# Altium project VNGS01 V1.32.PrjPcb
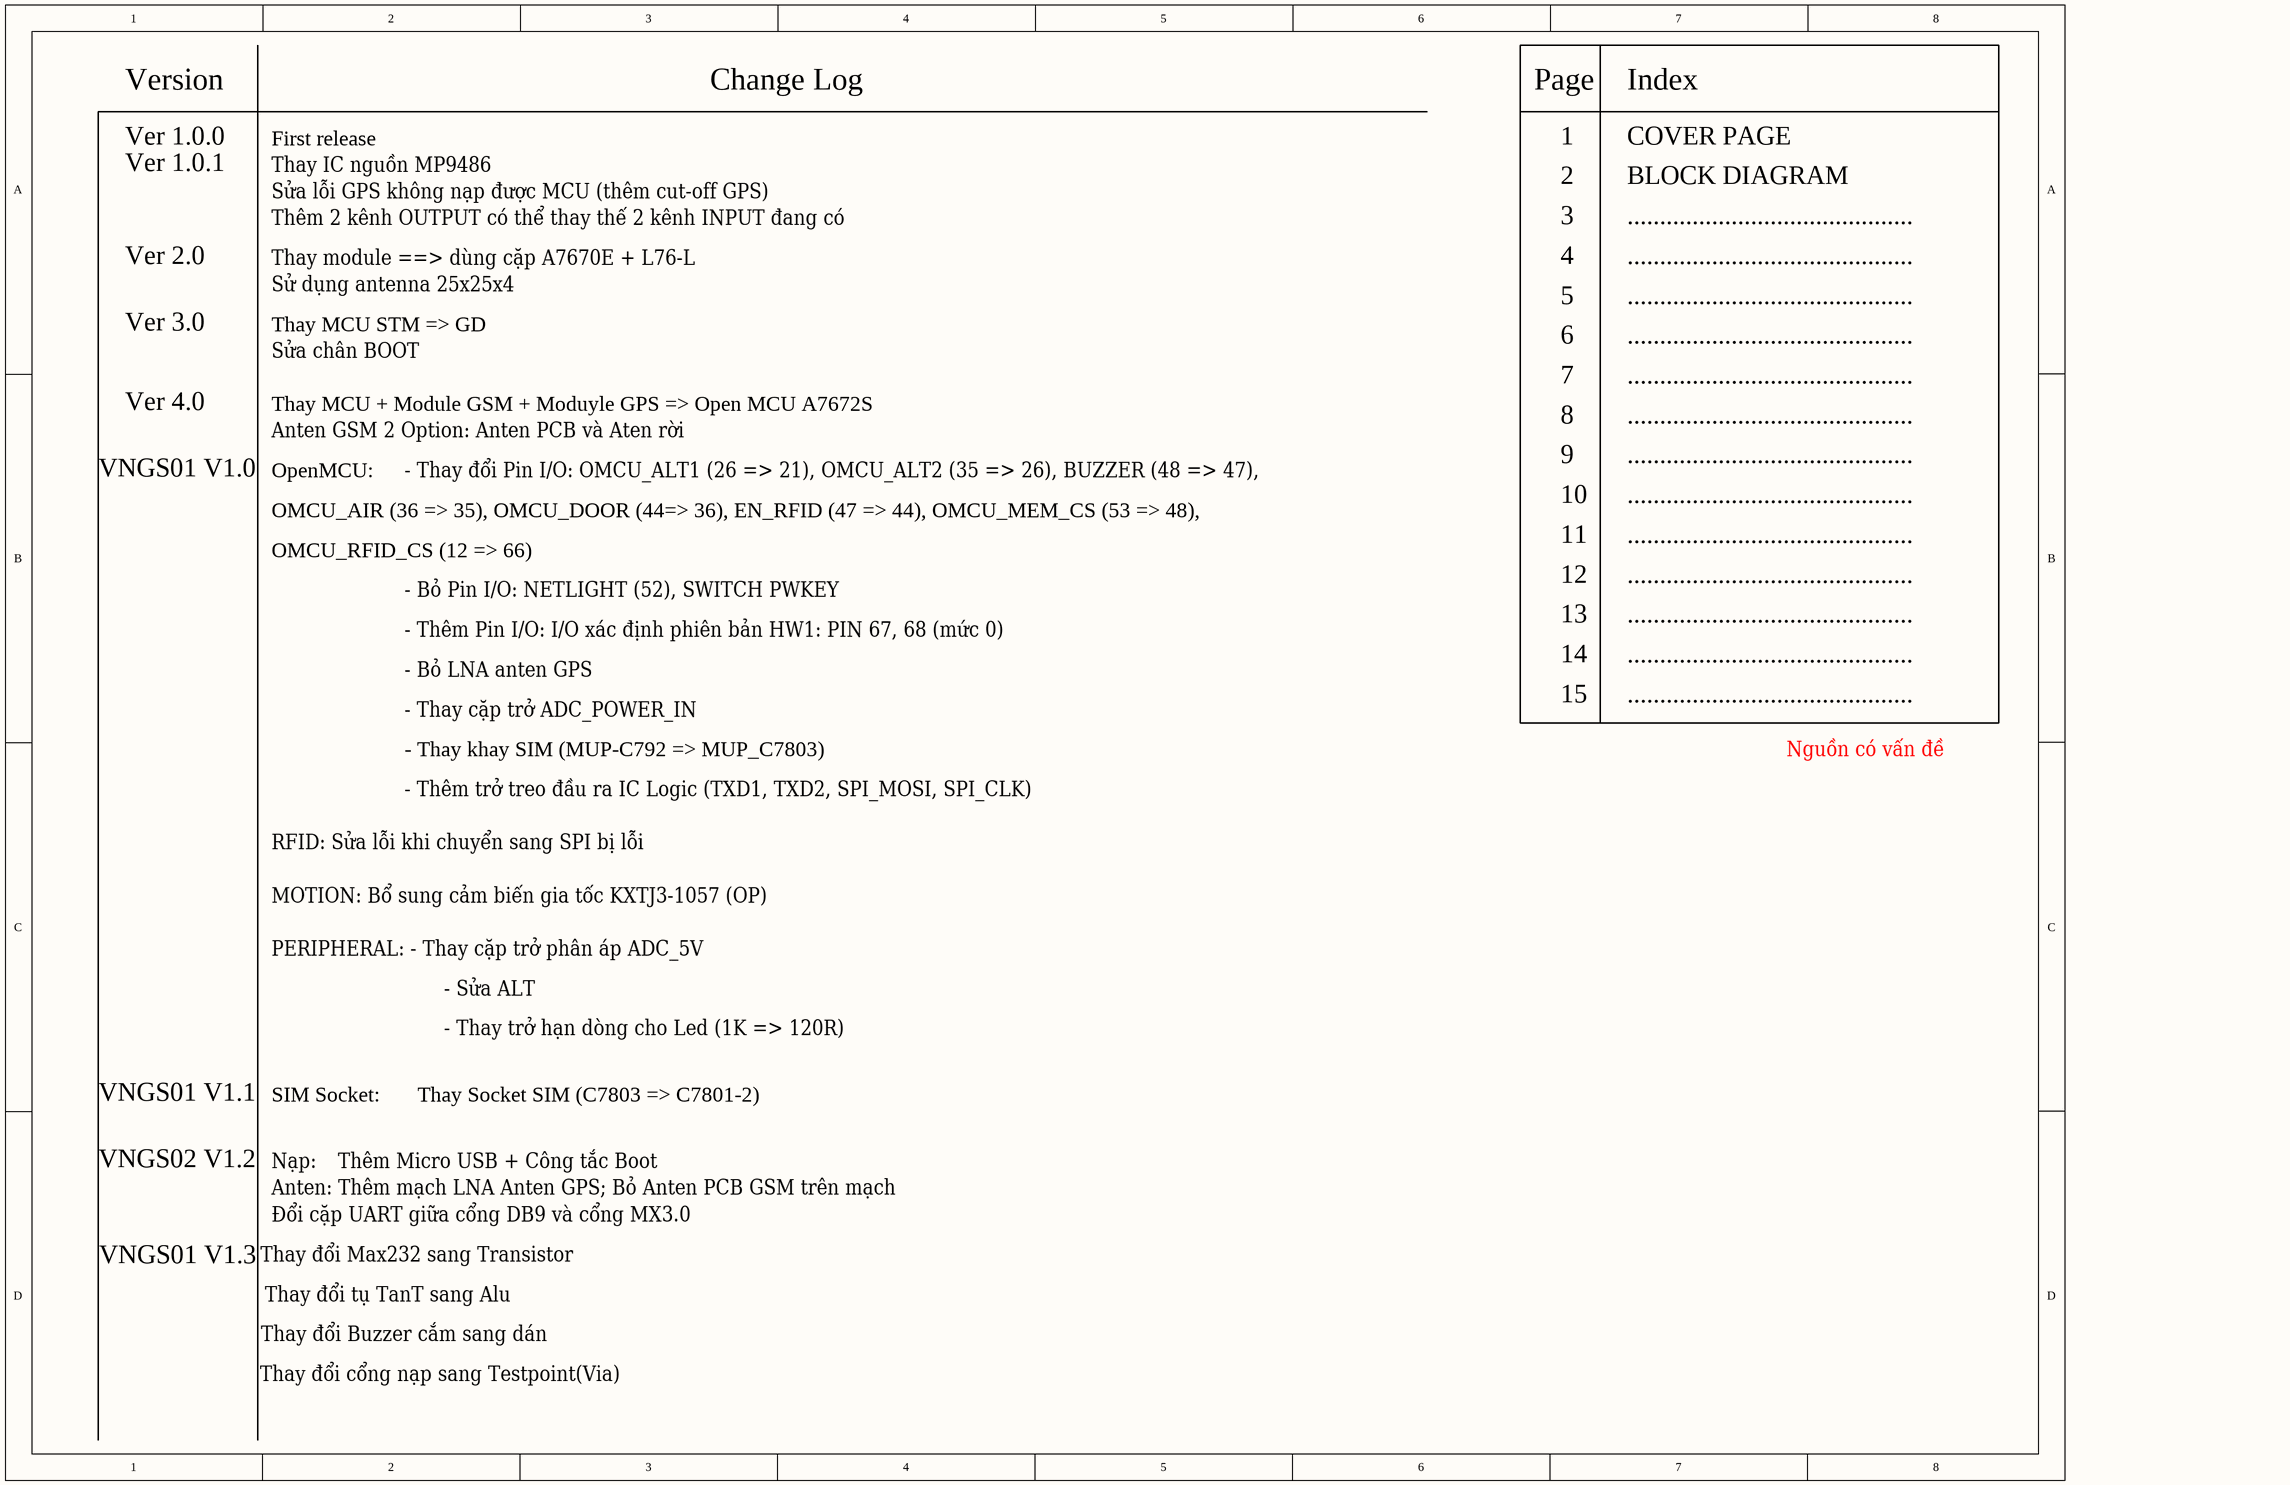
[diagram p0: 01 Cover.SchDoc]
4 sheets, 118 parts. Net scope: global (net labels, ports and power ports of the same name join across sheets).
Board file: VNGS01 V1.32.PcbDoc
Sheets:
  01 Cover.SchDoc
  03 Power DC.SchDoc
  04 Open MCU.SchDoc
  05 RFID.SchDoc

## Sheet 01 Cover.SchDoc
size A3

### Notes on the sheet
- Version
- Change Log
- Page
- Index
- Ver 1.0.0
- Ver 1.0.1
- First release
- Thay IC nguồn MP9486
- 1
- COVER PAGE
- Sửa lỗi GPS không nạp được MCU (thêm cut-off GPS)
- Thêm 2 kênh OUTPUT có thể thay thế 2 kênh INPUT đang có
- 2
- 3
- BLOCK DIAGRAM
- ............................................
- Ver 2.0
- Thay module ==> dùng cặp A7670E + L76-L
- Sử dụng antenna 25x25x4
- 4
- 5
- Ver 3.0
- Thay MCU STM => GD
- Sửa chân BOOT
- 6
- Ver 4.0
- Thay MCU + Module GSM + Moduyle GPS => Open MCU A7672S
- Anten GSM 2 Option: Anten PCB và Aten rời
- 7
- 8
- VNGS01 V1.0
- OpenMCU:
- - Thay đổi Pin I/O: OMCU_ALT1 (26 => 21), OMCU_ALT2 (35 => 26), BUZZER (48 => 47),
- 9
- 10
- OMCU_AIR (36 => 35), OMCU_DOOR (44=> 36), EN_RFID (47 => 44), OMCU_MEM_CS (53 => 48),
- OMCU_RFID_CS (12 => 66)
- 11
- - Bỏ Pin I/O: NETLIGHT (52), SWITCH PWKEY
- - Thêm Pin I/O: I/O xác định phiên bản HW1: PIN 67, 68 (mức 0)
- 12
- 13
- - Bỏ LNA anten GPS
- 14
- 15
- - Thay cặp trở ADC_POWER_IN
- - Thay khay SIM (MUP-C792 => MUP_C7803)
- Nguồn có vấn đề
- - Thêm trở treo đầu ra IC Logic (TXD1, TXD2, SPI_MOSI, SPI_CLK)
- RFID: Sửa lỗi khi chuyển sang SPI bị lỗi
- MOTION: Bổ sung cảm biến gia tốc KXTJ3-1057 (OP)
- PERIPHERAL: - Thay cặp trở phân áp ADC_5V
- - Sửa ALT
- - Thay trở hạn dòng cho Led (1K => 120R)
- VNGS01 V1.1
- SIM Socket:
- Thay Socket SIM (C7803 => C7801-2)
- VNGS02 V1.2
- Nạp:
- Thêm Micro USB + Công tắc Boot
- Anten: Thêm mạch LNA Anten GPS; Bỏ Anten PCB GSM trên mạch
- Đổi cặp UART giữa cổng DB9 và cổng MX3.0
- VNGS01 V1.3
- Thay đổi tụ TanT sang Alu
- Thay đổi Max232 sang Transistor
- Thay đổi Buzzer cắm sang dán
- Thay đổi cổng nạp sang Testpoint(Via)

## Sheet 03 Power DC.SchDoc: POWER DC
size A4; DrawnBy: Cuong RnD HW; Revision: V4.0
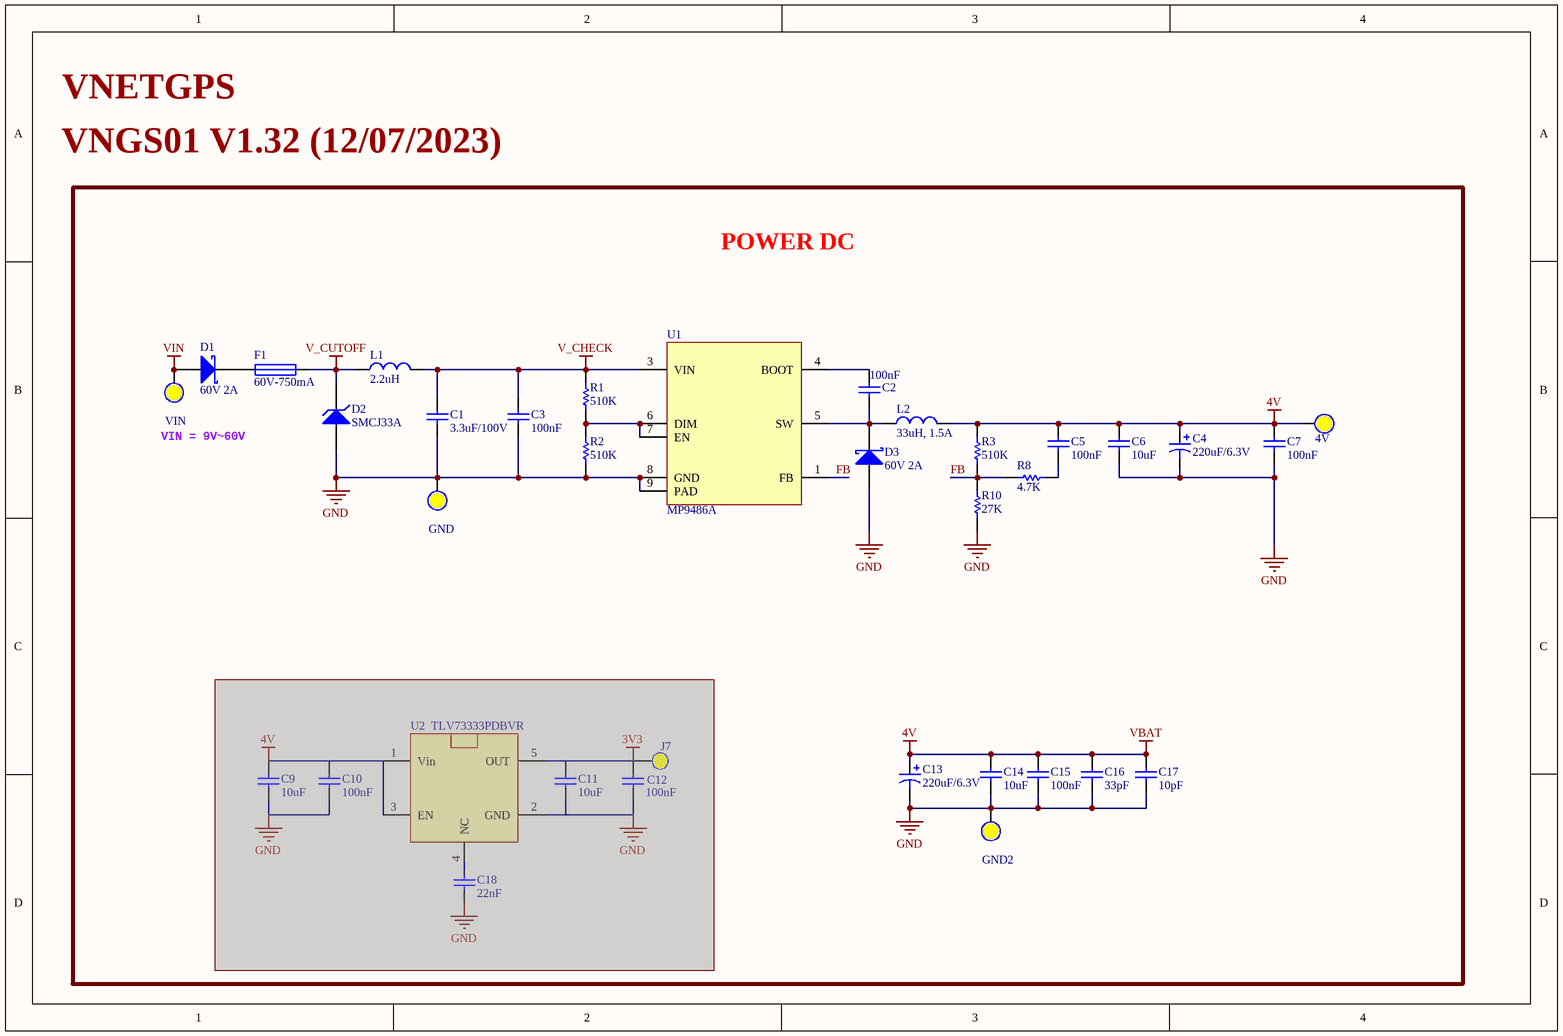
[diagram p1: 03 Power DC.SchDoc]

### Parts
(Parts that share a designator on the sheet are numbered #1, #2 ... from top to bottom, then left to right.)
4V  (no value)  [Test Point 1 MM]  (no BOM)
C1  3.3uF/100V  [1210 - C]
C2  100nF  [0603 - C]
C3  100nF  [0603 - C]
C4  220uF/6.3V  [CAP_ALUM_SMD_6354_TYPE_D]
C5  100nF  [0603 - C]
C6  10uF  [0603 - C]
C7  100nF  [0603 - C]
C9#1  10uF  [0603 - C]  (masked out: inside a compile mask, not in the netlist)
C10#1  100nF  [0603 - C]  (masked out: inside a compile mask, not in the netlist)
C11#1  10uF  [0603 - C]  (masked out: inside a compile mask, not in the netlist)
C12#1  100nF  [0603 - C]  (masked out: inside a compile mask, not in the netlist)
C13  220uF/6.3V  [CAP_ALUM_SMD_6354_TYPE_D]
C14  value 10uF  [0603 - C]  (hidden comment: 1uF)
C15  100nF  [0603 - C]
C16#1  33pF  [0603 - C]
C17  10pF  [0603 - C]
C18  22nF  [0603 - C]  (masked out: inside a compile mask, not in the netlist)
D1  60V 2A  [SOD-123]
D2  SMCJ33A  [DIODE - SMC]
D3  60V 2A  [SOD-123]
F1  60V-750mA  [2016 - Fuse]
GND  (no value)  [Test Point 1 MM]  (no BOM)
GND2  (no value)  [Test Point 1 MM]  (no BOM)
J7  Test Point  [TP1]  (value not drawn)  (masked out: inside a compile mask, not in the netlist)
L1  2.2uH  [1210 - L]
L2  33uH, 1.5A  [INDUCTOR-5D28]
R1  510K  [0603 - R]
R2  510K  [0603 - R]
R3  510K  [0603 - R]
R8  4.7K  [0603 - R]
R10#1  27K  [0603 - R]
U1  MP9486A  [SOIC8 - POWER]
U2#1  TLV73333PDBVR  [SOT23-5]  (masked out: inside a compile mask, not in the netlist)
VIN  (no value)  [Test Point 1 MM]  (no BOM)

### Nets
4V: 4V.0 C4.1 C5.1 C6.2 C7.2 C13.1 C14.2 C15.2 C16#1.2 C17.2 L2.2 R3.2  [also labelled VBAT]
GND: C1.1 C3.1 C4.2 C6.1 C7.1 C13.2 C14.1 C15.1 C16#1.1 C17.1 D2.1(A) D3.1(A) GND.0 GND2.0 R2.1 R10#1.1 U1.8(GND) U1.9(PAD)
V_CHECK: C1.2 C3.2 L1.2 R1.2 U1.3(VIN)
V_CUTOFF: D2.2(K) F1.2 L1.1
VIN: D1.1(A) VIN.0
FB: R3.1 R8.1 R10#1.2 U1.1(FB)
NetC2_1: C2.1 U1.4(BOOT)
NetC2_2: C2.2 D3.2(K) L2.1 U1.5(SW)
NetC5_2: C5.2 R8.2
NetD1_2: D1.2(K) F1.1
NetR1_1: R1.1 R2.2 U1.6(DIM) U1.7(EN)

### Notes on the sheet
- VNETGPS
- VNGS01 V1.32 (12/07/2023)
- POWER DC
- VIN = 9V~60V

### Library data of the parts
4V GND GND2 VIN = Test Point: Solder: NF
C1 = Cap 1210 3.3uF: CAP CER 3.3UF 100V X7S 1210; MPN: C3225X7S2A335M200AB; MFR: TDK Corporation; Company ID: VT_CAP_C1210 3.3uF 100V; Size: C1210: 3.3uF/100V; MPN2: 885012209071; Value: 3.3uF/100V
C2 C3 C5 C7 C10#1 C12#1 C15 = Cap 0603 100nF: CAP CER 100nF 50V C0G/NP0 0603; MPN: CL10C104JB8NNNC; MFR: SAMSUNG; Company ID: VT_TỤ ĐIỆN_C0603 100nF; Voltage: 50V; Package: 0603; Value: 100nF; Size: C0603: 100nF
C4 C13 = Cap Alu 220uF/6.3V: CAP.EL.220uF 6.3V 6.3x5.4 85C 2000H SMT; MPN: CS006M221E5APKKKV00R; MFR: Su'scon; Company ID: VT_CAP ALU 220uF 6.3V; Value: 220uF/6.3V
C6 C9#1 C11#1 C14 = Cap 0603 10uF: CAP CER 10UF 16V X5R 0603; MPN: EMK107BBJ106MA-T; MFR: Yageo; Company ID: VT_CAP_C0603 10uF; Size: C0603: 10uF; Package: 0603
  C6 C9#1 C11#1: Value: 10uF
C16#1 = Cap 0603 33pF: CAP CER 33PF 50V C0G 0603; MFR: Yageo; MPN: AC0603FRNPO9BN330; Company ID: VT_CAP_C0603 33pF; Size: C0603: 33pF; Value: 33pF
C17 = Cap 0603 10pF: CAP CER 10PF 50V C0G/NP0 0603; MPN: CL10C100JB8NNNC; MFR: SAMSUNG; Company ID: VT_CAP_C0603 10pF; Size: C0603: 10pF; Value: 10pF
C18 = Cap 0603 22nF_1: CAP CER 0.022UF 50V X7R 0603; MPN: CL10B823KB8NNNC; MFR: SAMSUNG; Company ID: VT_CAP_C0603 22nF; Size: C0603: 82nF; Value: 22nF
D1 D3 = Diode PMEG6020ER: DIODE SCHOTTKY 60V 2A SOD123W; MPN: PMEG6020ER,115; MFR: NXP; Company ID: VT_DIODE_PMEG6020ER
D2 = SMCJ33A: TVS DIODE 33V 36.7V; MFR: Bourns Inc.; MPN: SMCJ33ABTR-ND; Company ID: VT_DIODE_ SMCJ33
F1 = Fuse 60V - 750mA: PTC RESET FUSE 60V 750MA 2016; MFR: Littelfuse Inc.; MPN: 2016L075/60MR; Company ID: VT_Fuse_60V - 750mA
J7 = TP: 1mm - 1 layer
L1 = Inductor 3225 2.2uH: FIXED IND 2.2UH 1.6A 76 MOHM SMD; MPN: LQH32PN2R2NN0; MFR: Murata; Company ID: VT_IND_3225 2.2uH; Value: 2.2uH; Size: L3225: 2.2uH; MPN2: SWPA3015S2R2NT
L2 = Inductor 33uH, 1.5A: FIXED IND 33UH 1.5A 286 MOHM SMD; MPN: SWPA6028S330MT; MFR: SunLord; Company ID: VT_IND_33uH/1.5A
R1 R2 = Res 0603 510K: RES SMD 510K OHM 1% 1/10W 0603; MFR: Yageo; MPN: RC0603FR-07510KL; Company ID: VT_ĐIỆN TRỞ_R0603 510K; Value: 510K; Size: R0603: 510K
R3 = Res 0603 510K: RES SMD 510K OHM 1% 1/10W 0603; MFR: Yageo; MPN: RC0603FR-07510KL; Company ID: VT_RES_R0603 510K; Size: R0603: 510K; Value: 510K
R8 = Res 0603 4.7K: RES SMD 4.7K OHM 1% 1/10W 0603; MFR: Yageo; MPN: RC0603FR-074K7L; Company ID: VT_RES_R0603 4.7K; Size: R0603: 4.7K; Value: 4.7K
R10#1 = Res 0603 27K: RES SMD 27K OHM 1% 1/10W 0603; MFR: YAGEO; MPN: AF0603FR-0727KL; Company ID: VT_RES_R0603 27K; Size: R0603: 27K; Value: 27K
U1 = MP9486AG: IC REG 100V INPT 3.5A SWITCH CUR; MPN: MP9486AGN-Z; MFR: MPS; Company ID: VT_IC_MP9486A
U2#1 = TLV73333PDBVR: IC REG LINEAR 3.3V 300MA SOT23-5; MFR: TI; Company ID: VT_IC_TLV73333; MPN: TLV73333PDBVR

## Sheet 04 Open MCU.SchDoc
size A3
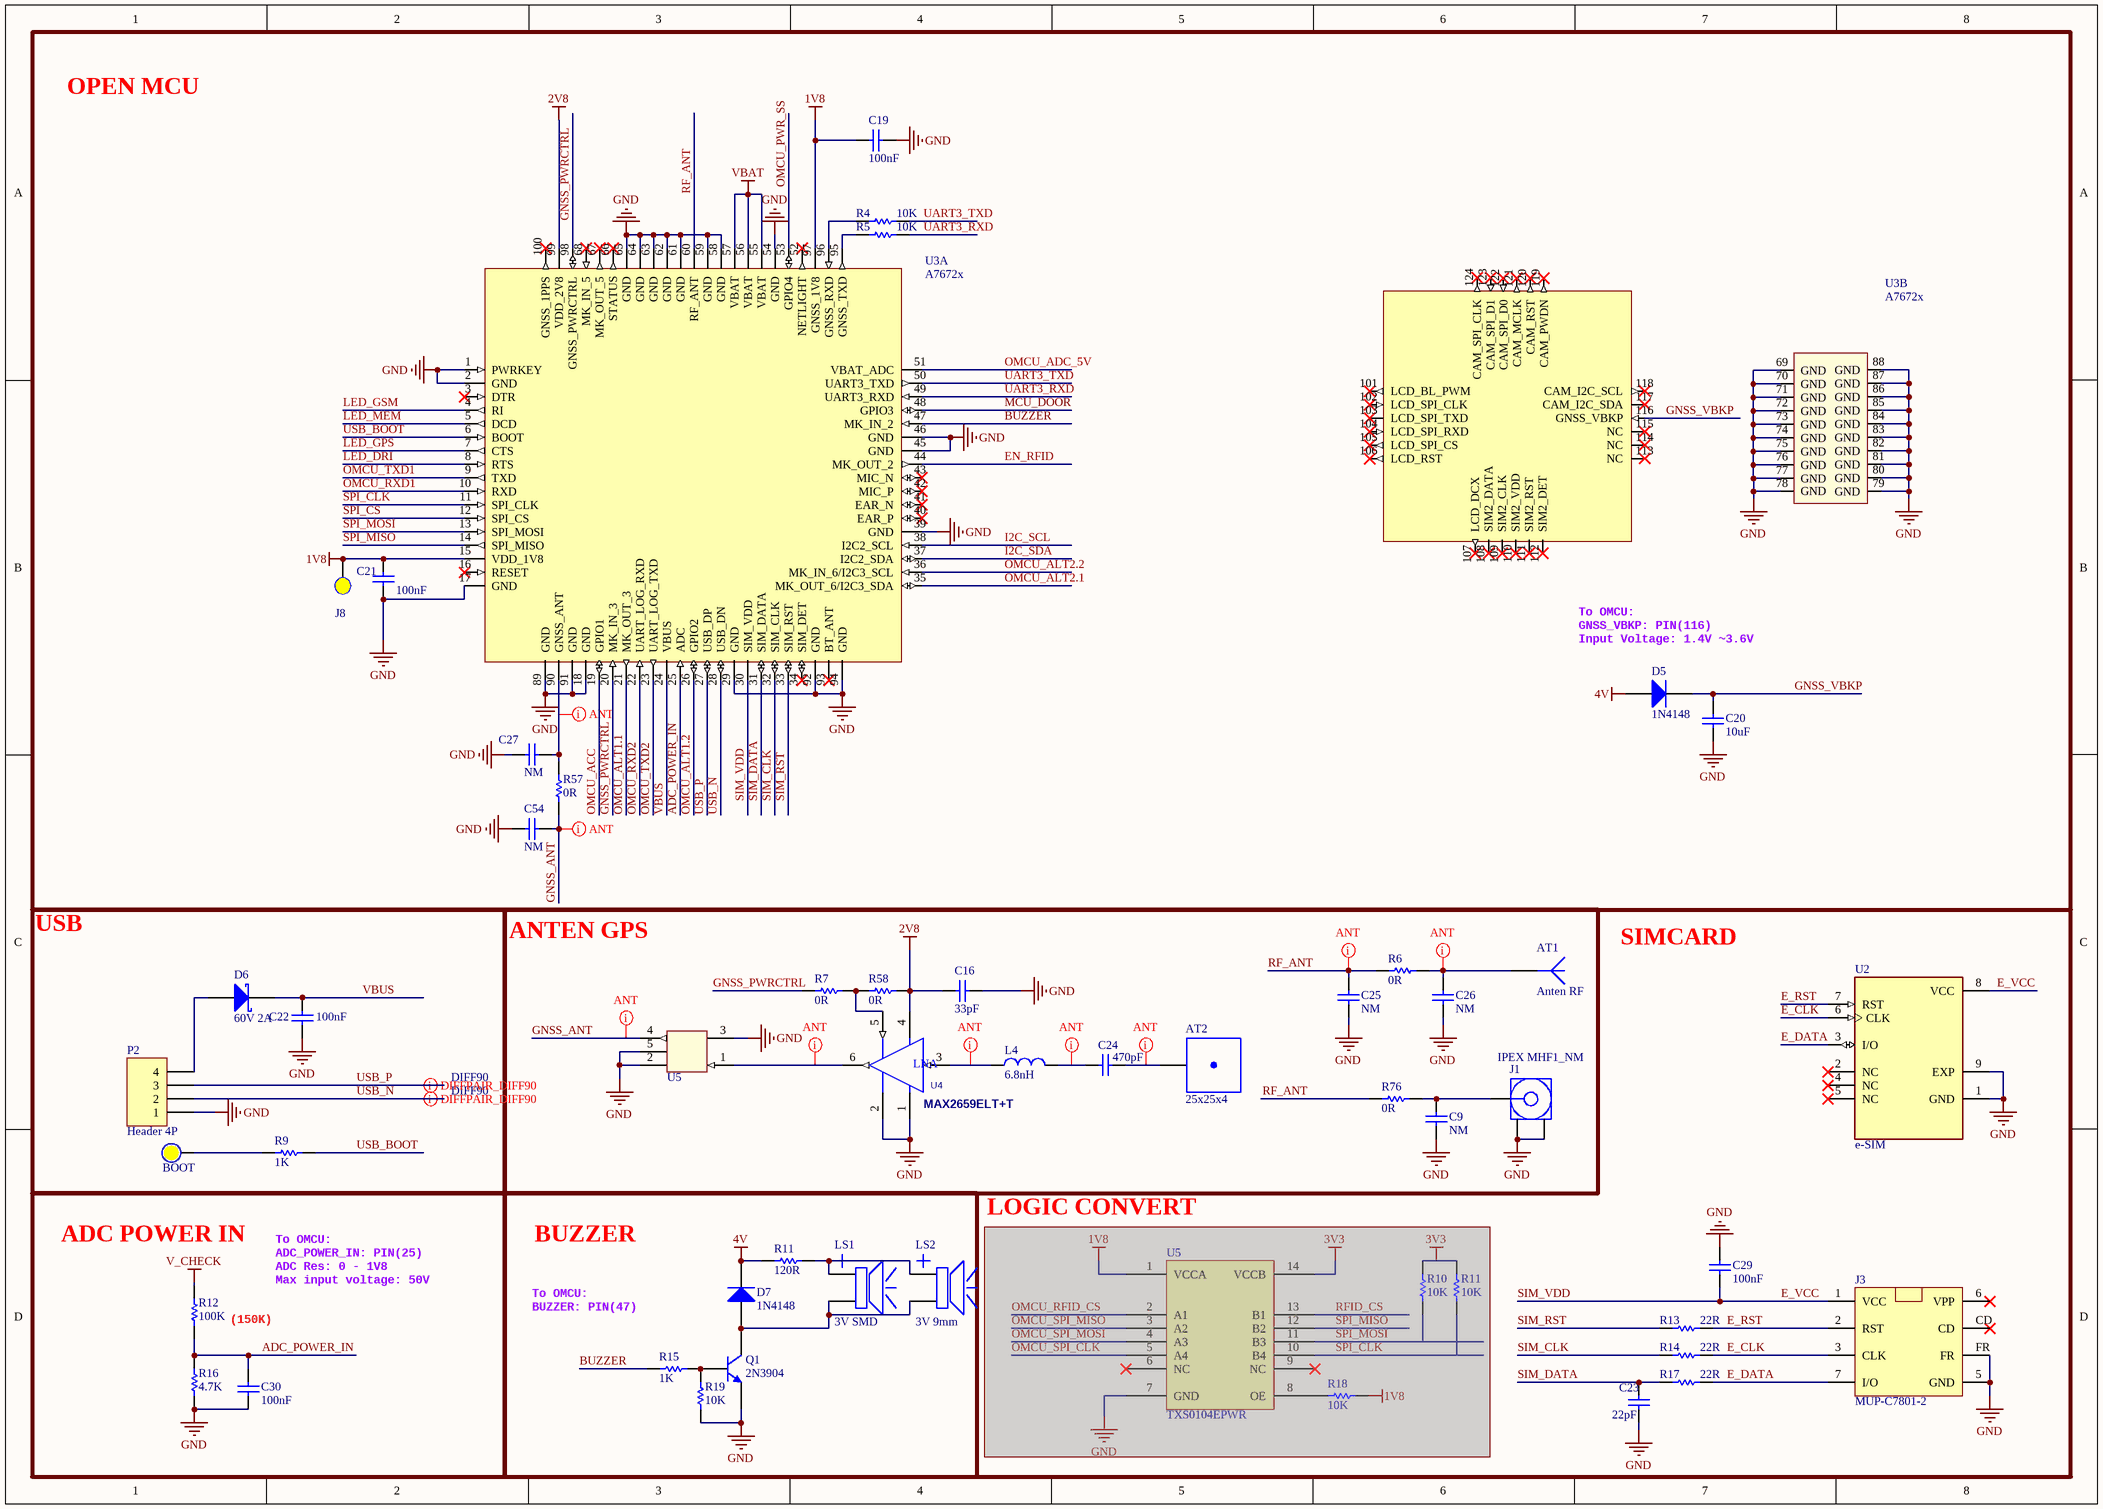
[diagram p2: 04 Open MCU.SchDoc]

### Parts
(Parts that share a designator on the sheet are numbered #1, #2 ... from top to bottom, then left to right.)
AT1  Anten RF  [ANT_GSM]
AT2  25x25x4  [Jinchang - 1575]
BOOT  (no value)  [Test Point 1 MM]  (no BOM)
C9#2  NM  [0402 - C]
C16#2  33pF  [0603 - C]
C19  value 100nF  [0603 - C]  (hidden comment: 2.2uF)
C20  value 10uF  [0603 - C]  (hidden comment: 2.2uF)
C21  100nF  [0603 - C]
C22  100nF  [0603 - C]
C23  22pF  [0603 - C]
C24  470pF  [0402 - C]
C25  NM  [0402 - C]
C26  NM  [0402 - C]
C27  NM  [0402 - C]
C29  100nF  [0603 - C]
C30  100nF  [0603 - C]
C54  NM  [0402 - C]
D5  1N4148  [SOD-123]
D6  60V 2A  [SOD-123]
D7  1N4148  [SOD-123]
J1  IPEX MHF1_NM  [IPEX]
J3  MUP-C7801-2  [MUP-C7801-2]
J8  1V8  [TP1]  (value not drawn)
L4  6.8nH  [0402 - L]
LS1  3V SMD  [Buzzer - SMD - 1]
LS2  3V 9mm  [Buzzer]
P2  Header 4P  [HDR1X4]
Q1  2N3904  [SOT23B]
R4  10K  [0603 - R]
R5  10K  [0603 - R]
R6  0R  [0402 - R]
R7  0R  [0402 - R]
R9  1K  [0603 - R]
R10#2  10K  [0603 - R]  (masked out: inside a compile mask, not in the netlist)
R11#1  120R  [0603 - R]
R11#2  10K  [0603 - R]  (masked out: inside a compile mask, not in the netlist)
R12  100K  [0603 - R]
R13  22R  [0603 - R]
R14  22R  [0603 - R]
R15  1K  [0603 - R]
R16  4.7K  [0603 - R]
R17  22R  [0603 - R]
R18#1  10K  [0603 - R]  (masked out: inside a compile mask, not in the netlist)
R19  10K  [0603 - R]
R57  0R  [0402 - R]
R58  0R  [0402 - R]
R76  0R  [0402 - R]
U2#2  e-SIM  [E-SIM 5*6mm]
U3  A7672x  [A7672]  (parts A,B of 2)
U4  MAX2659ELT+T  [SOT886]
U5#1  SAFFB1G56KB0F0A  [SAFFB1G56KB0F0A]  (value not drawn)
U5#2  TXS0104EPWR  [TSOP65P640X120-14N]  (masked out: inside a compile mask, not in the netlist)

### Blocks framed on the sheet
OPEN MCU: C19-C21 C27 C54 D5 J8 R4 R5 R57 U3
USB: BOOT C22 D6 P2 R9
ANTEN GPS: AT1 AT2 C9#2 C16#2 C24-C26 J1 L4 R6 R7 R58 R76 U4 U5#1
ADC POWER IN: C30 R12 R16
BUZZER: D7 LS1 LS2 Q1 R11#1 R15 R19

### Nets
1V8: C19.1 C21.1 J8.1 U3.15(VDD_1V8) U3.97(GNSS_1V8)
2V8: C16#2.2 R58.1 U3.99(VDD_2V8) U4.4(VCC)
4V: D5.1(A) D7.2(K) R11#1.1 U3.55(VBAT) U3.56(VBAT) U3.57(VBAT)  [also labelled VBAT]
GND: C9#2.1 C16#2.1 C19.2 C20.1 C21.2 C22.1 C23.1 C25.1 C26.1 C27.2 C29.2 C30.1 C54.2 J1.2 J3.5(GND) J3.FR P2.1 Q1.2(E) R16.1 R19.1 U2#2.1(GND) U2#2.9(EXP) U3.1(PWRKEY) U3.2(GND) U3.17(GND) U3.18(GND) U3.29(GND) U3.39(GND) U3.45(GND) U3.46(GND) U3.54(GND) U3.58(GND) U3.59(GND) U3.61(GND) U3.62(GND) U3.63(GND) U3.64(GND) U3.65(GND) U3.69(GND) U3.70(GND) U3.71(GND) U3.72(GND) U3.73(GND) U3.74(GND) U3.75(GND) U3.76(GND) U3.77(GND) U3.78(GND) U3.79(GND) U3.80(GND) U3.81(GND) U3.82(GND) U3.83(GND) U3.84(GND) U3.85(GND) U3.86(GND) U3.87(GND) U3.88(GND) U3.89(GND) U3.91(GND) U3.92(GND) U3.94(GND) U4.1(GND) U4.2(GND) U5#1.2(RST) U5#1.3(IO2) U5#1.5(VDD)
V_CHECK: R12.2
ADC_POWER_IN: C30.2 R12.1 R16.2 U3.25(ADC)
BUZZER: R15.1 U3.47(MK_IN_2)
E_CLK: J3.3(CLK) R14.2 U2#2.6(CLK)
E_DATA: J3.7(I/O) R17.2 U2#2.3(I/O)
E_RST: J3.2(RST) R13.2 U2#2.7(RST)
E_VCC: C29.1 J3.1(VCC) U2#2.8(VCC) U3.30(SIM_VDD)  [also labelled SIM_VDD]
EN_RFID: U3.44(MK_OUT_2)
GNSS_ANT: C54.1 R57.1 U5#1.4
GNSS_PWRCTRL: R7.1 U3.20(MK_IN_3) U3.98(GNSS_PWRCTRL)
GNSS_VBKP: C20.2 D5.2(K) U3.116(GNSS_VBKP)
I2C_SCL: U3.38(I2C2_SCL)
I2C_SDA: U3.37(I2C2_SDA)
LED_DRI: U3.8(RTS)
LED_GPS: U3.7(CTS)
LED_GSM: U3.4(RI)
LED_MEM: U3.5(DCD)
MCU_DOOR: U3.48(GPIO3)
OMCU_ACC: U3.19(GPIO1)
OMCU_ADC_5V: U3.51(VBAT_ADC)
OMCU_ALT1.1: U3.21(MK_OUT_3)
OMCU_ALT1.2: U3.26(GPIO2)
OMCU_ALT2.1: U3.35(MK_OUT_6/I2C3_SDA)
OMCU_ALT2.2: U3.36(MK_IN_6/I2C3_SCL)
OMCU_PWR_SS: U3.53(GPIO4)
OMCU_RXD1: U3.10(RXD)
OMCU_RXD2: U3.22(UART_LOG_RXD)
OMCU_TXD1: U3.9(TXD)
OMCU_TXD2: U3.23(UART_LOG_TXD)
RF_ANT: C25.2 R6.1 R76.1 U3.60(RF_ANT)
SIM_CLK: R14.1 U3.32(SIM_CLK)
SIM_DATA: C23.2 R17.1 U3.31(SIM_DATA)
SIM_RST: R13.1 U3.33(SIM_RST)
SPI_CLK: U3.11(SPI_CLK)
SPI_CS: U3.12(SPI_CS)
SPI_MISO: U3.14(SPI_MISO)
SPI_MOSI: U3.13(SPI_MOSI)
UART3_RXD: R5.2 U3.49(UART3_RXD)
UART3_TXD: R4.2 U3.50(UART3_TXD)
USB_BOOT: R9.2 U3.6(BOOT)
USB_N: P2.2 U3.28(USB_DN)
USB_P: P2.3 U3.27(USB_DP)
VBUS: C22.2 D6.2(K) U3.24(VBUS)
NetAT1_1: AT1.1(A) C26.2 R6.2
NetAT2_1: AT2.1(ANT) C24.2
NetBOOT_0: BOOT.0 R9.1
NetC9#2_2: C9#2.2 J1.1(A) R76.2
NetC24_1: C24.1 L4.2
NetC27_1: C27.1 R57.2 U3.90(GNSS_ANT)
NetD6_1: D6.1(A) P2.4
NetD7_1: D7.1(A) LS1.2 LS2.2 Q1.3(C)
NetL4_1: L4.1 U4.3(RF_IN)
NetLS1_1: LS1.1 LS2.1 R11#1.2
NetQ1_1: Q1.1(B) R15.2 R19.2
NetR4_1: R4.1 U3.96(GNSS_RXD)
NetR5_1: R5.1 U3.95(GNSS_TXD)
NetR7_2: R7.2 R58.2 U4.5(EN)
NetU4_6: U4.6(RF_OUT) U5#1.1(RX)

Not connected (* = marked no-connect by the designer): J3 6(VPP)* CD*; U2#2 2(NC)* 4(NC)* 5(NC)*; U3 3(DTR)* 16(RESET)* 34(SIM_DET)* 40(EAR_P)* 41(EAR_N)* 42(MIC_P)* 43(MIC_N)* 52(NETLIGHT)* 66(STATUS)* 67(MK_OUT_5)* 68(MK_IN_5)* 93(BT_ANT)* 100(GNSS_1PPS)* 101(LCD_BL_PWM)* 102(LCD_SPI_CLK)* 103(LCD_SPI_TXD)* 104(LCD_SPI_RXD)* 105(LCD_SPI_CS)* 106(LCD_RST)* 107(LCD_DCX)* 108(SIM2_DATA)* 109(SIM2_CLK)* 110(SIM2_VDD)* 111(SIM2_RST)* 112(SIM2_DET)* 113(NC)* 114(NC)* 115(NC)* 117(CAM_I2C_SDA)* 118(CAM_I2C_SCL)* 119(CAM_PWDN)* 120(CAM_RST)* 121(CAM_MCLK)* 122(CAM_SPI_D0)* 123(CAM_SPI_D1)* 124(CAM_SPI_CLK)*

### Layout directives
differential pair; differential pair class DIFF90: USB_N, USB_P
net class RF: GNSS_ANT, NetAT1_1, NetAT2_1, NetC24_1, NetC27_1, NetL4_1, NetU4_6, RF_ANT

### Notes on the sheet
- GNSS_VBKP: PIN(116)
- Input Voltage: 1.4V ~3.6V
- To OMCU:
- SIMCARD
- ADC_POWER_IN: PIN(25)
- LOGIC CONVERT
- (150K)
- ADC Res: 0 - 1V8
- Max input voltage: 50V
- BUZZER: PIN(47)
- (in symbol MAX2659) LNA

### Library data of the parts
AT1 = ANT_GSM_PCB: Antenna GSM PCB; Brand: VNET; Part Number: PCB
AT2 = ANT-GPS 25x25: 25x25x4mm thick GPS Patch Antenna; MPN: JTDT1575-1602S; MFR: Jinchang & Amotech; Company ID: VT_ANT_GPS 1596; MPN2: A25-4102820-AMT23
BOOT = Test Point: Solder: NF
C9#2 C25-C27 C54 = Cap 0402 NM: CAP CER NM X5R 0402; MFR: Yageo; Company ID: VT_TỤ ĐIỆN_C0402 NM; Voltage: 6.3V; MPN: NM; Size: C0402: NM; Package: 0402; Value: NM
C16#2 = Cap 0603 33pF: as C16#1 on sheet 03 Power DC; Size: C0603: 33pF; Value: 33pF
C19 C21 C29 C30 = Cap 0603 100nF: as C2 on sheet 03 Power DC; Voltage: 50V; Package: 0603; Size: C0603: 100nF
  C21 C29 C30: Value: 100nF
C20 = Cap 0603 10uF: as C6 on sheet 03 Power DC; Size: C0603: 10uF; Package: 0603
C22 = Cap 0603 100nF: CAP CER 100nF 50V C0G/NP0 0603; MPN: CL10C104JB8NNNC; MFR: SAMSUNG; Company ID: VT_CAP_C0603 100nF; Voltage: 50V; Package: 0603; Size: C0603: 100nF; Value: 100nF
C23 = Cap 0603 22pF: CAP CER 22PF 50V C0G/NP0 0603; MPN: CL10C220JB8NNNC; MFR: SAMSUNG; Company ID: VT_TỤ ĐIỆN_C0603 22pF; Value: 22pF; Size: C0603: 22pF
C24 = Cap 0402 470pF: CAP CER 470PF 50V X7R 0402; MPN: CL05B471JB5NNNC; MFR: Samsung; Company ID: VT_TỤ ĐIỆN_C0402 470pF; Voltage: 50V; Size: C0402: 820pF; Package: 0402; Value: 470pF
D5 D7 = Diode 1N4148: DIODE GEN PURP 100V 300MA SOD123; MPN: 1N4148W-7-F; MFR: DIODES; Company ID: VT_DIODE_1N4148W-7-F
D6 = Diode PMEG6020ER: as D1 on sheet 03 Power DC
J1 = IPEX: CONN UMC RCPT STR 50 OHM SMD; MPN: RECE.20279.001E.01; MFR: Taoglas; Company ID: VT_CONN_IPEX; MPN2: MUP-R4151
J3 = Socket Nano SIM MUP-C7801-2: Socket Nano Sim 7pin (6+1); MFR: MUP; Company ID: VT_CONN_SIM MUP-C7801-2; MPN: MUP-C7801-2
J8 = TP: 1mm - 1 layer
L4 = Inductor 0402 6.8nH: FIXED IND 6.8NH 430MA 250 MOHM; MPN: HK10056N8J-T; MFR: Taiyo Yuden; Company ID: VT_IND_0402 6.8nH; Size: L0402: 6.8nH; Value: 6.8nH
LS1 = Speaker SMD: AUDIO MAGNETIC IND 2-5V SMD; MFR: China; MPN: CMI-9653S-SMT; COmpany ID: VT_Buzzer 3V 9mm SMD
LS2 = Speaker: Buzzer 9*6mm (D*h); MFR: China; MPN: TMB09A03; Company ID: VT_Buzzer 3V 9mm
P2 = Header 4x1: Header, 4 Pin Pitch 2.54mm; MPN: S1012EC-40-ND; CompanyID: VT-00125; Solder: WAVE; Value: Header 4P
Q1 = Transistor 2N3904: TRANS NPN 40V 0.2A SOT-23; MPN: MMBT3904; MFR: Fairchild; Company ID: VT_TRANSISTOR_3904
R4 R5 R10#2 R11#2 R18#1 = Res 0603 10K: RES SMD 10K OHM 1% 1/10W 0603; MFR: Yageo; MPN: RC0603FR-0710KL; Company ID: VT_RES_R0603 10K; Size: R0603: 10K; Value: 10K
R6 R7 R57 R58 R76 = Res 0402 0R: RES SMD 0 OHM JUMPER 1/16W 0402; MFR: Yageo; MPN: RC0402FR-070RL; Company ID: VT_ĐIỆN TRỞ_R0402 0R; Size: R0402: 0R; Package: 0402; Value: 0R
R9 R15 = Res 0603 1K: RES SMD 1K OHM 1% 1/10W 0603; MFR: Yageo; MPN: RC0603FR-071KL; Company ID: VT_RES_R0603 1K; Size: R0603: 1K; Value: 1K
R11#1 = Res 0603 120R: RES SMD 120 OHM 1% 1/10W 0603; MFR: Yageo; MPN: AF0603FR-07120RL; Company ID: VT_RES_ R0603 120R; Size: R0603: 120R; Value: 120R
R12 = Res 0603 100K: RES SMD 100K OHM 1% 1/10W 0603; MFR: Yageo; MPN: RC0603FR-07100KL; Company ID: VT_RES_R0603 100K; Size: R0603: 100K; Value: 100K
R13 R14 R17 = Res 0603 22R: RES SMD 22 OHM 1% 1/10W 0603; MFR: Yageo; MPN: RC0603FR-0722RL; Company ID: VT_ĐIỆN TRỞ_R0603 22R; Value: 22R; Size: R0603: 22R
R16 = Res 0603 4.7K: as R8 on sheet 03 Power DC; Size: R0603: 4.7K; Value: 4.7K
R19 = Res 0603 10K: RES SMD 10K OHM 1% 1/10W 0603; MFR: Yageo; MPN: RC0603FR-0710KL; Company ID: VT_ĐIỆN TRỞ_R0603 10K; Value: 10K; Size: R0603: 10K
U2#2 = SIM-E-MFF2-GL-250: SIM Cards eUICC MFF2 Global SIM; MFR: HoloGram; Solder: SMT; MPN: SIM-E-MFF2-GL-250; Value: e-SIM; Category: IC; PinCount: 8
U3 = A7672x: LTE CAT 1 module, 2,3,4G; MFR: SIMCOM; MPN: A7672S; Company ID: VT_Module_A7672S
U4 = MAX2659: IC RF AMP GPS 1575.42MHZ 6UDFN; MFR: Maxim Integrated; Company ID: VT_IC_MAX2659; MPN: MAX2659ELT+T
U5#1 = SAFFB1G56KB0F0A: SAW Filter RF 1561.1MHz /1575.42MHz/1602MHz 1.9dB 50Ohm SMD 5 Pin Ammo; MFR: Murata; Category: MODULE; MPN: SAFFB1G56KB0F0A; PinCount: 5; Value: SAFFB1G56KB0F0A
U5#2 = TXS0104EPWR: IC 4BIT NON-INV TRANSLTR 14TSSOP; Solder: SMT; Value: TXS0104EPWR; MPN: TXS0104EPWR; Category: IC

## Sheet 05 RFID.SchDoc
size A
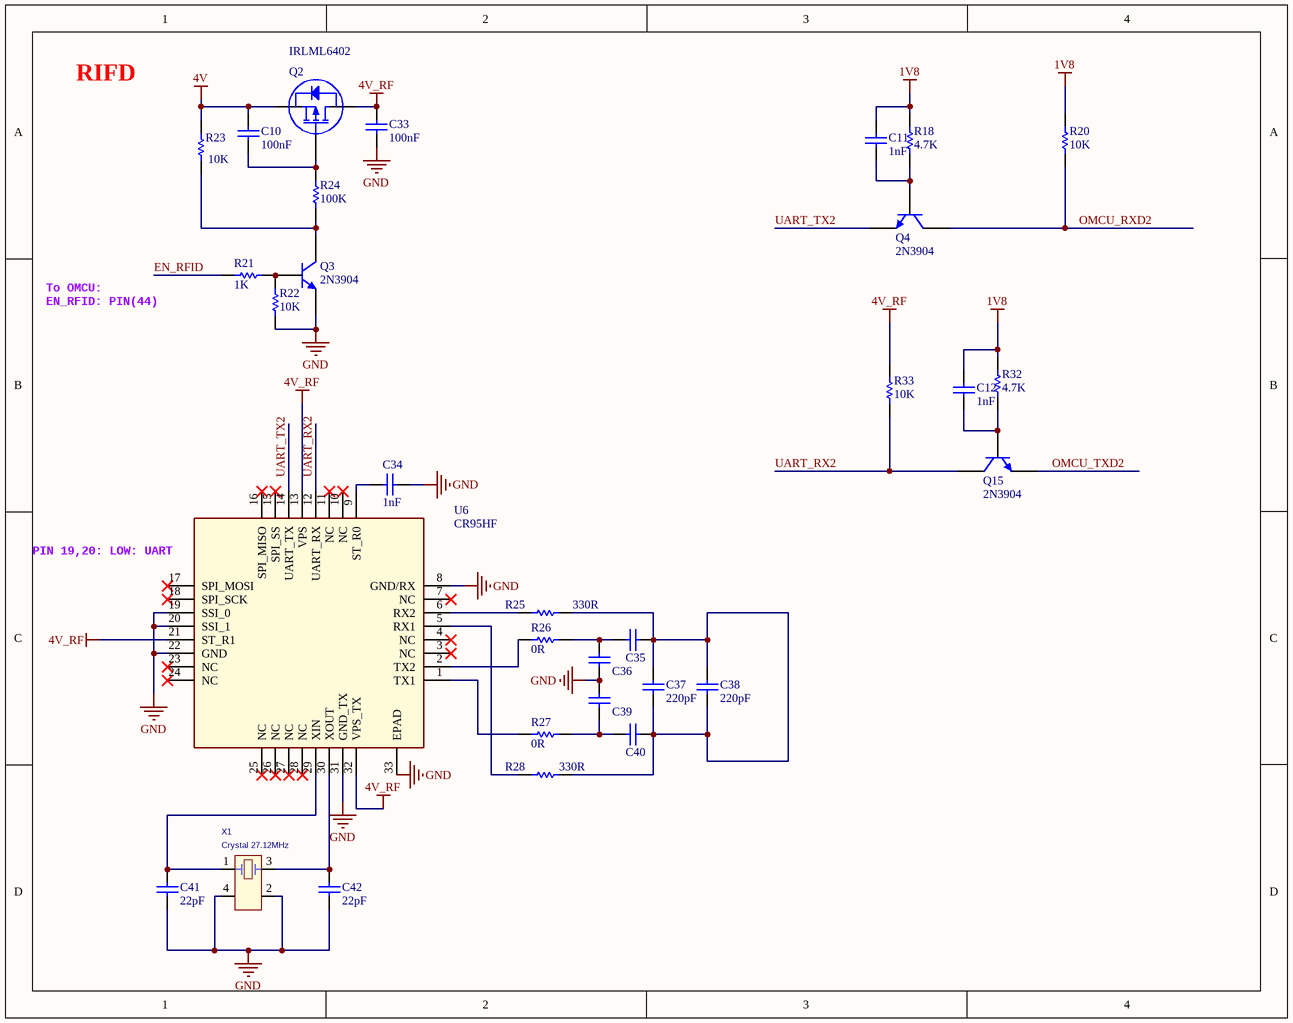
[diagram p3: 05 RFID.SchDoc]

### Parts
(Parts that share a designator on the sheet are numbered #1, #2 ... from top to bottom, then left to right.)
C10#2  100nF  [0603 - C]
C11#2  1nF  [0603 - C]
C12#2  1nF  [0603 - C]
C33  100nF  [0603 - C]
C34  1nF  [0603 - C]
C35  150pF  [0603 - C]  (value not drawn)
C36  150pF  [0603 - C]  (value not drawn)
C37  220pF  [0603 - C]
C38  220pF  [0603 - C]
C39  150pF  [0603 - C]  (value not drawn)
C40  150pF  [0603 - C]  (value not drawn)
C41  22pF  [0603 - C]
C42  22pF  [0603 - C]
Q2  IRLML6402  [SOT23B]
Q3  2N3904  [SOT23B]
Q4  2N3904  [SOT23B]
Q15  2N3904  [SOT23B]
R18#2  4.7K  [0603 - R]
R20  10K  [0603 - R]
R21  1K  [0603 - R]
R22  10K  [0603 - R]
R23  10K  [0603 - R]
R24  100K  [0603 - R]
R25  330R  [0603 - R]
R26  0R  [0603 - R]
R27  0R  [0603 - R]
R28  330R  [0603 - R]
R32  4.7K  [0603 - R]
R33  10K  [0603 - R]
U6  CR95HF  [32-VFQFN]
X1  Crystal 27.12MHz  [Crystal 2016]

### Nets
1V8: C11#2.2 C12#2.2 R18#2.2 R20.2 R32.2
4V: C10#2.2 Q2.2(S) R23.2
4V_RF: C33.2 Q2.3(D) R33.2 U6.13(VPS) U6.21(ST_R1) U6.32(VPS_TX)
GND: C33.1 C34.2 C36.1 C39.2 C41.1 C42.1 Q3.2(E) R22.1 U6.8(GND/RX) U6.19(SSI_0) U6.20(SSI_1) U6.22(GND) U6.31(GND_TX) U6.33(EPAD) X1.2(GND) X1.4(GND)
EN_RFID: R21.1
OMCU_RXD2: Q4.3(C) R20.1
OMCU_TXD2: Q15.2(E)
UART_RX2: Q15.3(C) R33.1 U6.12(UART_RX)
UART_TX2: Q4.2(E) U6.14(UART_TX)
NetC10#2_1: C10#2.1 Q2.1(G) R24.2
NetC11#2_1: C11#2.1 Q4.1(B) R18#2.1
NetC12#2_1: C12#2.1 Q15.1(B) R32.1
NetC34_1: C34.1 U6.9(ST_R0)
NetC35_1: C35.1 C36.2 R26.2
NetC35_2: C35.2 C37.1 C37.2 C38.1 C38.2 C40.2 R25.2 R28.2
NetC39_1: C39.1 C40.1 R27.2
NetC41_2: C41.2 U6.29(XIN) X1.1(OSC1)
NetC42_2: C42.2 U6.30(XOUT) X1.3(OSC2)
NetQ3_1: Q3.1(B) R21.2 R22.2
NetQ3_3: Q3.3(C) R23.1 R24.1
NetR25_1: R25.1 U6.6(RX2)
NetR26_1: R26.1 U6.2(TX2)
NetR27_1: R27.1 U6.1(TX1)
NetR28_1: R28.1 U6.5(RX1)

Not connected (* = marked no-connect by the designer): U6 3(NC)* 4(NC)* 7(NC)* 10(NC)* 11(NC)* 15(SPI_SS)* 16(SPI_MISO)* 17(SPI_MOSI)* 18(SPI_SCK)* 23(NC)* 24(NC)* 25(NC)* 26(NC)* 27(NC)* 28(NC)*

### Notes on the sheet
- RIFD
- To OMCU:
- EN_RFID: PIN(44)
- (near U6) PIN 19,20: LOW: UART

### Library data of the parts
C10#2 C33 = Cap 0603 100nF: as C22 on sheet 04 Open MCU; Voltage: 50V; Package: 0603; Size: C0603: 100nF; Value: 100nF
C11#2 C12#2 = Cap 0603 1nF: CAP CER 1000PF 50V C0G/NP0 0603; MPN: CL10C102JB8NNNC; MFR: SAMSUNG; Company ID: VT_CAP_C0603 1nF; Size: C0603: 1nF; Value: 1nF
C34 = Cap 0603 1nF: CAP CER 1000PF 50V C0G/NP0 0603; MPN: CL10C102JB8NNNC; MFR: SAMSUNG; Company ID: VT_TỤ ĐIỆN_C0603 1nF; Size: C0603: 1nF; Value: 1nF
C35 C36 C39 C40 = Cap 0603 150pF: CAP CER 150PF 50V C0G/NP0 0603; MPN: CL10C151JB8NNNC; MFR: SAMSUNG; Company ID: VT_TỤ ĐIỆN_C0603 150pF; Value: 150pF; Size: C0603: 150pF
C37 C38 = Cap 0603 220pF: CAP CER 220PF 50V C0G/NP0 0603; MPN: CL10C221JB8NNNC; MFR: SAMSUNG; Company ID: VT_TỤ ĐIỆN_C0603 220pF; Value: 220pF; Size: C0603: 220pF
C41 C42 = Cap 0603 22pF: as C23 on sheet 04 Open MCU; Value: 22pF; Size: C0603: 22pF
Q2 = IRLML6402TRPBF: MOSFET P-CH 30V 3.6A SOT-23-3; MFR: Infineon Technologies; Categories: TRANSISTOR; MPN: IRLML6402TRPBF
Q3 Q4 Q15 = Transistor 2N3904: as Q1 on sheet 04 Open MCU
R18#2 R32 = Res 0603 4.7K: as R8 on sheet 03 Power DC; Size: R0603: 4.7K; Value: 4.7K
R20 R23 R33 = Res 0603 10K: as R4 on sheet 04 Open MCU; Size: R0603: 10K; Value: 10K
R21 = Res 0603 1K: as R9 on sheet 04 Open MCU; Size: R0603: 1K; Value: 1K
R22 = Res 0603 10K: as R19 on sheet 04 Open MCU; Value: 10K; Size: R0603: 10K
R24 = Res 0603 100K: as R12 on sheet 04 Open MCU; Size: R0603: 100K; Value: 100K
R25 R28 = Res 0603 330R: RES SMD 330OHM 1% 1/10W 0603; MFR: Yageo; MPN: RC0603FR-07330RL; Company ID: VT_ĐIỆN TRỞ_R0603 330R; Value: 330R; Size: R0603: 330R
R26 R27 = Res 0603 0R: RES SMD 0 OHM JUMPER 1/10W 0603; MFR: Yageo; MPN: RC0603FR-070RL; Company ID: VT_ĐIỆN TRỞ_R0603 0R; Size: R0603: 0R; Value: 0R
U6 = CR95HF: IC RFID RDR/TRN 13.56MZ 32VFQFPN; MPN: CR95HF-VMD5T; MFR: ST; Company ID: VT_IC_CR95HF
X1 = XTAL-XRCBG27M: CRYSTAL 27.12MHz RoHS; MPN: XRCGB27M120F3M00R0; MFR: Murata; Company ID: VT_CRYSTAL_SMD 27.12MHz

## Nets that join several sheets
1V8: 04 Open MCU (5 pins), 05 RFID (5 pins)
4V: 03 Power DC (12 pins), 04 Open MCU (6 pins), 05 RFID (C10#2.2 Q2.2 R23.2)
GND: 03 Power DC (18 pins), 04 Open MCU (67 pins), 05 RFID (16 pins)
V_CHECK: 03 Power DC (5 pins), 04 Open MCU (R12.2)
EN_RFID: 04 Open MCU (U3.44), 05 RFID (R21.1)
OMCU_RXD2: 04 Open MCU (U3.22), 05 RFID (Q4.3 R20.1)
OMCU_TXD2: 04 Open MCU (U3.23), 05 RFID (Q15.2)

## Assembly variants
V01: not fitted C25 C26 C27 C28 C31 C47 C52 C53 C? R1 R2 R8 R38 R39 R51 R59 R64 R69 R?